# Altium schematic sheet MainBoard.SchDoc
size A3
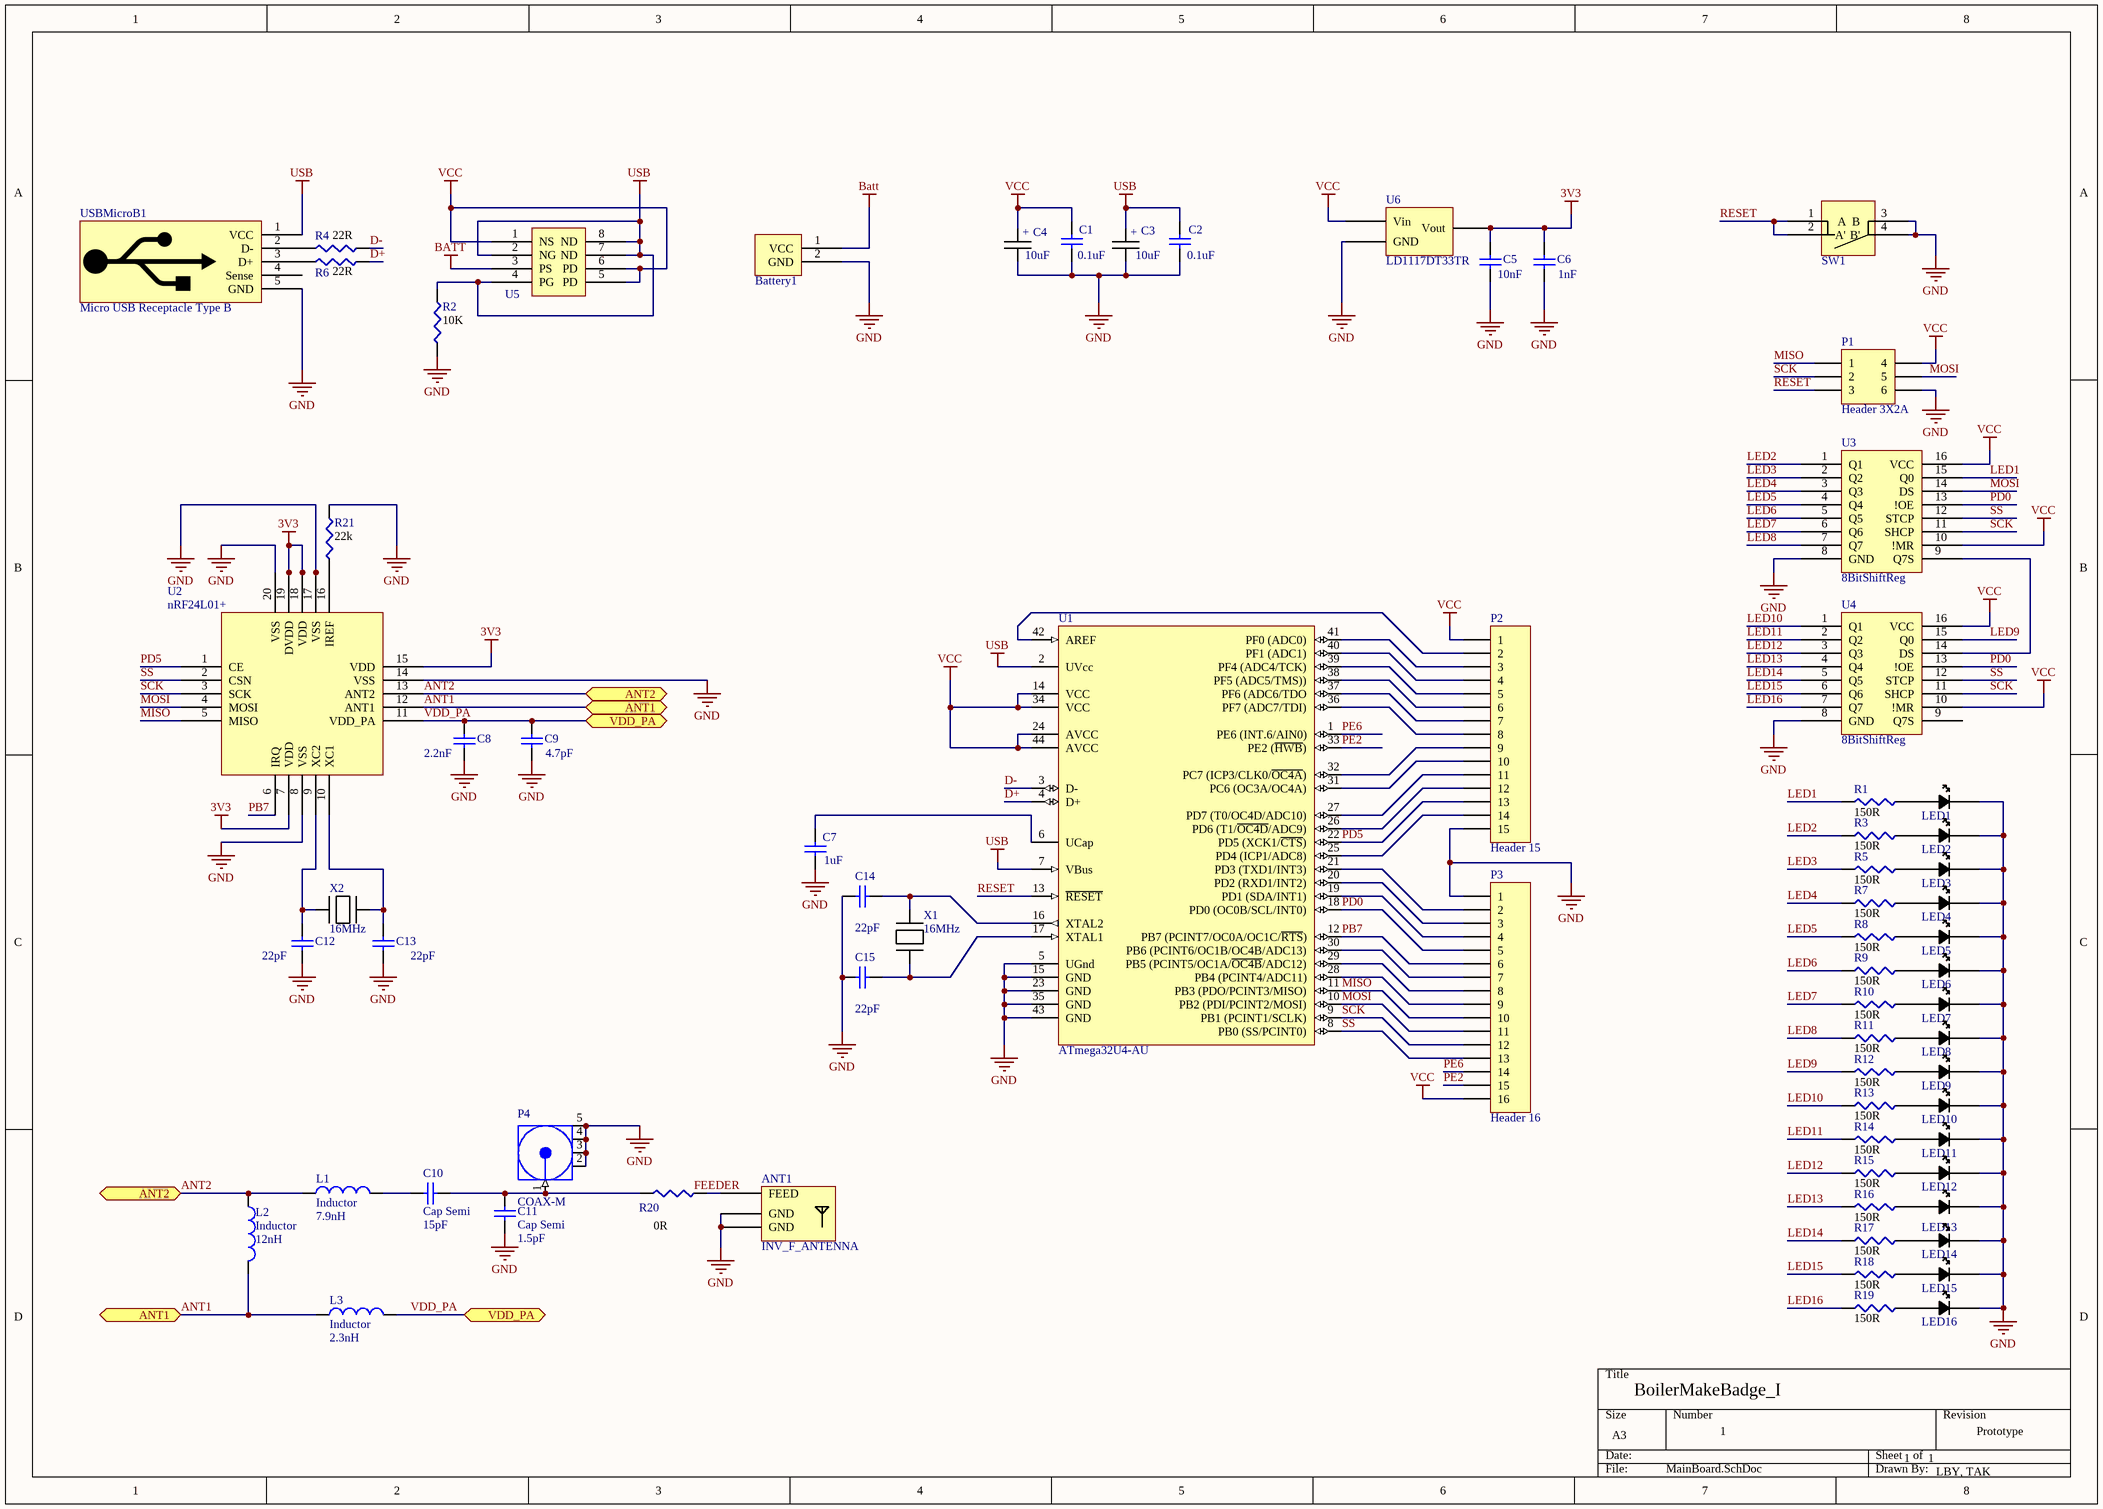
[diagram p0: MainBoard.SchDoc]

## Parts
ANT1  INV_F_ANTENNA  [INV_F_PCB_ANTENNA]
Battery1  PowerPins  [PowerPins_PCB]  (value not drawn)
C1  value 0.1uF  [C1206]  (hidden comment: Cap Semi)
C2  value 0.1uF  [C1206]  (hidden comment: Cap Semi)
C3  value 10uF  [sheityCapPackage]  (hidden comment: Electrolytic Capacitor)
C4  value 10uF  [sheityCapPackage]  (hidden comment: Electrolytic Capacitor)
C5  value 10nF  [C1206]  (hidden comment: Cap Semi)
C6  value 1nF  [C1206]  (hidden comment: Cap Semi)
C7  value 1uF  [C1206]  (hidden comment: Cap Semi)
C8  value 2.2nF  [0402]  (hidden comment: Cap Semi)
C9  value 4.7pF  [0402]  (hidden comment: Cap Semi)
C10  Cap Semi  value 15pF  [0402]
C11  Cap Semi  value 1.5pF  [C1206]
C12  value 22pF  [C1206]  (hidden comment: Cap Semi)
C13  value 22pF  [C1206]  (hidden comment: Cap Semi)
C14  value 22pF  [C1206]  (hidden comment: Cap Semi)
C15  value 22pF  [C1206]  (hidden comment: Cap Semi)
L1  Inductor  value 7.9nH  [0402-A]
L2  Inductor  value 12nH  [0402-A]
L3  Inductor  value 2.3nH  [0402-A]
LED1  LED_Green_1206Package  [1206Package_PCB]  (value not drawn)
LED2  LED_Green_1206Package  [1206Package_PCB]  (value not drawn)
LED3  LED_Green_1206Package  [1206Package_PCB]  (value not drawn)
LED4  LED_Green_1206Package  [1206Package_PCB]  (value not drawn)
LED5  LED_Green_1206Package  [1206Package_PCB]  (value not drawn)
LED6  LED_Green_1206Package  [1206Package_PCB]  (value not drawn)
LED7  LED_Green_1206Package  [1206Package_PCB]  (value not drawn)
LED8  LED_Green_1206Package  [1206Package_PCB]  (value not drawn)
LED9  LED_Green_1206Package  [1206Package_PCB]  (value not drawn)
LED10  LED_Green_1206Package  [1206Package_PCB]  (value not drawn)
LED11  LED_Green_1206Package  [1206Package_PCB]  (value not drawn)
LED12  LED_Green_1206Package  [1206Package_PCB]  (value not drawn)
LED13  LED_Green_1206Package  [1206Package_PCB]  (value not drawn)
LED14  LED_Green_1206Package  [1206Package_PCB]  (value not drawn)
LED15  LED_Green_1206Package  [1206Package_PCB]  (value not drawn)
LED16  LED_Green_1206Package  [1206Package_PCB]  (value not drawn)
P1  Header 3X2A  [HDR2X3_CEN]
P2  Header 15  [HDR1X15]
P3  Header 16  [HDR1X16]
P4  COAX-M  [MMCX2.54-V5]
R1  value 150R  [1206Package_PCB]  (hidden comment: Resistor_1206Package)
R2  value 10K  [1206Package_PCB]  (hidden comment: Resistor_1206Package)
R3  value 150R  [1206Package_PCB]  (hidden comment: Resistor_1206Package)
R4  value 22R  [1206Package_PCB]  (hidden comment: Resistor_1206Package)
R5  value 150R  [1206Package_PCB]  (hidden comment: Resistor_1206Package)
R6  value 22R  [1206Package_PCB]  (hidden comment: Resistor_1206Package)
R7  value 150R  [1206Package_PCB]  (hidden comment: Resistor_1206Package)
R8  value 150R  [1206Package_PCB]  (hidden comment: Resistor_1206Package)
R9  value 150R  [1206Package_PCB]  (hidden comment: Resistor_1206Package)
R10  value 150R  [1206Package_PCB]  (hidden comment: Resistor_1206Package)
R11  value 150R  [1206Package_PCB]  (hidden comment: Resistor_1206Package)
R12  value 150R  [1206Package_PCB]  (hidden comment: Resistor_1206Package)
R13  value 150R  [1206Package_PCB]  (hidden comment: Resistor_1206Package)
R14  value 150R  [1206Package_PCB]  (hidden comment: Resistor_1206Package)
R15  value 150R  [1206Package_PCB]  (hidden comment: Resistor_1206Package)
R16  value 150R  [1206Package_PCB]  (hidden comment: Resistor_1206Package)
R17  value 150R  [1206Package_PCB]  (hidden comment: Resistor_1206Package)
R18  value 150R  [1206Package_PCB]  (hidden comment: Resistor_1206Package)
R19  value 150R  [1206Package_PCB]  (hidden comment: Resistor_1206Package)
R20  value 0R  [1206Package_PCB]  (hidden comment: Resistor_1206Package)
R21  value 22k  [1206Package_PCB]  (hidden comment: Resistor_1206Package)
SW1  PushButton  [TactileSwitchPCB]  (value not drawn)
U1  ATmega32U4-AU  [44ML_N]
U2  nRF24L01+  [20-VFQFN]
U3  8BitShiftReg  [16-SOIC]
U4  8BitShiftReg  [16-SOIC]
U5  DualNP-ChFET  [8-SOIC]  (value not drawn)
U6  LD1117DT33TR  [DPAK]
USBMicroB1  Micro USB Receptacle Type B  [USBMicroB_PCB]
X1  value 16MHz  [HC-49S]  (hidden comment: HC-49S)
X2  value 16MHz  [HC-49S]  (hidden comment: HC-49S)

## Ports
ANT1, ANT2, VDD_PA

## Nets
3V3: C6.2 U2.7(VDD) U2.15(VDD) U2.18(VDD) U2.19(DVDD) U6.2(Vout)
Batt: Battery1.1(VCC) U5.3(PS)
GND: ANT1.1(GND) ANT1.2(GND) Battery1.2(GND) C1.1 C2.1 C3.2 C4.2 C5.1 C6.1 C7.2 C8.1 C9.1 C11.2 C12.1 C13.1 C14.2 C15.2 LED1.2 LED2.2 LED3.2 LED4.2 LED5.2 LED6.2 LED7.2 LED8.2 LED9.2 LED10.2 LED11.2 LED12.2 LED13.2 LED14.2 LED15.2 LED16.2 P1.6 P2.15 P3.1 P4.2(GND) P4.3(GND) P4.4(GND) P4.5(GND) R2.1 R21.2 SW1.3(B) SW1.4(B') U1.5(UGnd) U1.15(GND) U1.23(GND) U1.35(GND) U1.43(GND) U2.8(VSS) U2.14(VSS) U2.17(VSS) U2.20(VSS) U3.8(GND) U4.8(GND) U6.1(GND) USBMicroB1.5(GND)
USB: C2.2 C3.1 R2.2 U1.2(UVcc) U1.7(VBus) U5.2(NG) U5.4(PG) U5.7(ND) U5.8(ND) USBMicroB1.1(VCC)
VCC: C1.2 C4.1 P1.4 P2.1 P3.16 U1.14(VCC) U1.24(AVCC) U1.34(VCC) U1.44(AVCC) U3.10(!MR) U3.16(VCC) U4.10(!MR) U4.16(VCC) U5.1(NS) U5.5(PD) U5.6(PD) U6.3(Vin)
ANT1: L2.2 L3.1 U2.12(ANT1) ; port ANT1
ANT2: L1.1 L2.1 U2.13(ANT2) ; port ANT2
D+: R6.1 U1.4(D+)
D-: R4.1 U1.3(D-)
LED1: R1.1 U3.15(Q0)
LED2: R3.1 U3.1(Q1)
LED3: R5.1 U3.2(Q2)
LED4: R7.1 U3.3(Q3)
LED5: R8.1 U3.4(Q4)
LED6: R9.1 U3.5(Q5)
LED7: R10.1 U3.6(Q6)
LED8: R11.1 U3.7(Q7)
LED9: R12.1 U4.15(Q0)
LED10: R13.1 U4.1(Q1)
LED11: R14.1 U4.2(Q2)
LED12: R15.1 U4.3(Q3)
LED13: R16.1 U4.4(Q4)
LED14: R17.1 U4.5(Q5)
LED15: R18.1 U4.6(Q6)
LED16: R19.1 U4.7(Q7)
MISO: P1.1 P3.10 U1.11(PB3_(PDO/PCINT3/MISO)) U2.5(MISO)
MOSI: P1.5 P3.11 U1.10(PB2_(PDI/PCINT2/MOSI)) U2.4(MOSI) U3.14(DS)
PB7: P3.6 U1.12(PB7_(PCINT7/OC0A/OC1C/~{RTS})) U2.6(IRQ)
PD0: P3.5 U1.18(PD0_(OC0B/SCL/INT0)) U3.13(!OE) U4.13(!OE)
PD5: P2.13 U1.22(PD5_(XCK1/~{CTS})) U2.1(CE)
PE2: P3.15 U1.33(PE2_(~{HWB}))
PE6: P3.14 U1.1(PE6_(INT.6/AIN0))
RESET: P1.3 SW1.1(A) SW1.2(A') U1.13(~{RESET})
SCK: P1.2 P3.12 U1.9(PB1_(PCINT1/SCLK)) U2.3(SCK) U3.11(SHCP) U4.11(SHCP)
SS: P3.13 U1.8(PB0_(SS/PCINT0)) U2.2(CSN) U3.12(STCP) U4.12(STCP)
VDD_PA: C8.2 C9.2 L3.2 U2.11(VDD_PA) ; port VDD_PA
NetANT1_3: ANT1.3(FEED) R20.2
NetC7_1: C7.1 U1.6(UCap)
NetC10_1: C10.1 C11.1 P4.1(Signal) R20.1
NetC10_2: C10.2 L1.2
NetC12_2: C12.2 U2.9(XC2) X2.1
NetC13_2: C13.2 U2.10(XC1) X2.2
NetC14_1: C14.1 U1.16(XTAL2) X1.2
NetC15_1: C15.1 U1.17(XTAL1) X1.1
NetLED1_1: LED1.1 R1.2
NetLED2_1: LED2.1 R3.2
NetLED3_1: LED3.1 R5.2
NetLED4_1: LED4.1 R7.2
NetLED5_1: LED5.1 R8.2
NetLED6_1: LED6.1 R9.2
NetLED7_1: LED7.1 R10.2
NetLED8_1: LED8.1 R11.2
NetLED9_1: LED9.1 R12.2
NetLED10_1: LED10.1 R13.2
NetLED11_1: LED11.1 R14.2
NetLED12_1: LED12.1 R15.2
NetLED13_1: LED13.1 R16.2
NetLED14_1: LED14.1 R17.2
NetLED15_1: LED15.1 R18.2
NetLED16_1: LED16.1 R19.2
NetP2_2: P2.2 U1.42(AREF)
NetP2_3: P2.3 U1.41(PF0_(ADC0))
NetP2_4: P2.4 U1.40(PF1_(ADC1))
NetP2_5: P2.5 U1.39(PF4_(ADC4/TCK))
NetP2_6: P2.6 U1.38(PF5_(ADC5/TMS)))
NetP2_7: P2.7 U1.37(PF6_(ADC6/TDO)
NetP2_8: P2.8 U1.36(PF7_(ADC7/TDI))
NetP2_9: P2.9 U1.32(PC7_(ICP3/CLK0/~{OC4A}))
NetP2_10: P2.10 U1.31(PC6_(OC3A/OC4A))
NetP2_11: P2.11 U1.27(PD7_(T0/OC4D/ADC10))
NetP2_12: P2.12 U1.26(PD6_(T1/~{OC4D}/ADC9))
NetP2_14: P2.14 U1.25(PD4_(ICP1/ADC8))
NetP3_2: P3.2 U1.21(PD3_(TXD1/INT3))
NetP3_3: P3.3 U1.20(PD2_(RXD1/INT2))
NetP3_4: P3.4 U1.19(PD1_(SDA/INT1))
NetP3_7: P3.7 U1.30(PB6_(PCINT6/OC1B/OC4B/ADC13))
NetP3_8: P3.8 U1.29(PB5_(PCINT5/OC1A/~{OC4B}/ADC12))
NetP3_9: P3.9 U1.28(PB4_(PCINT4/ADC11))
NetR4_2: R4.2 USBMicroB1.2(D-)
NetR6_2: R6.2 USBMicroB1.3(D+)
NetR21_1: R21.1 U2.16(IREF)
NetU3_9: U3.9(Q7S) U4.14(DS)

Not connected (* = marked no-connect by the designer): C5 2; U4 9(Q7S); USBMicroB1 4(Sense)

## Notes on the sheet
- BoilerMakeBadge_I
- 1
- Prototype
- 1      1
- LBY, TAK
- Labels drawn without touching a wire or pin: FEEDER
- (in symbol Electrolytic Capacitor) +

## Library data of the parts
ANT1 = INV_V_ANTENNA
C1 C2 C5-C15 = Cap Semi: Capacitor (Semiconductor SIM Model); Published: 8-Jun-2000; LatestRevisionDate: 29-May-2009; LatestRevisionNote: IPC-7351 Footprint Added.; PackageReference: C1206; Publisher: Altium Limited; PackageDescription: Chip Capacitor
C3 C4 = Electrolytic Capacitor: asdf
L1-L3 = Inductor: Code_IEC: 1005; Published: 8-Jun-2000; LatestRevisionDate: 29-May-2009; LatestRevisionNote: IPC-7351 Footprint Added.; PackageReference: 0402-A; Publisher: Altium Limited; PackageDescription: Chip Inductor; Code_JEITA: 0402
LED1-LED16 = LED_Green_1206Package: Green LED
P1 = Header 3X2A: Header, 3-Pin, Dual row; LatestRevisionDate: 17-Jul-2002; LatestRevisionNote: Re-released for DXP Platform.; Publisher: Altium Limited
P2 = Header 15: Header, 15-Pin; LatestRevisionDate: 17-Jul-2002; LatestRevisionNote: Re-released for DXP Platform.; Publisher: Altium Limited
P3 = Header 16: Header, 16-Pin; LatestRevisionDate: 17-Jul-2002; LatestRevisionNote: Re-released for DXP Platform.; Publisher: Altium Limited
P4 = COAX-M: RF Coaxial PCB Connector, MMCX; Thru-Hole, Vertical Mount Plug,  50 Ohm Impedance; PackageDocument: Rev. A, 16-Jun-1997; PCB_Layout: Complies with manufacturer's recommendation.; DrillSize: Corresponds to nominal value.; Published: 15-Jul-2004; LatestRevisionDate: 15-Jul-2004; LatestRevisionNote: Component Replaced.; DatasheetDocument: 30-May-2003; PackageReference: 908-21103; Publisher: Altium Limited; ComponentLink1Description: Manufacturer Link; ComponentLink1URL: http://www.amphenolrf.com/
R1-R21 = Resistor_1206Package: Resistor 1206
SW1 = TactileButton: Normally open push button.
U1 = ATmega32U4-AU: 8-bit AVR Microcontroller, 2.7-5.5V, 32KB Flash, 2.5KB EEPROM, 1KB SRAM, USB Controller, 44-pin TQFP, Industrial Grade (-40°C to 85°C); Published: 1-Apr-2010; DatasheetVersion: revD, Jan-2009; PackageVersion: rev.G, Jul-2007; PackageReference: 44ML; Publisher: Altium Limited; PackageDescription: 44-Pin Plastic Thin Quad Flat Pack, 10 x 10 x 1.0 mm Body, 0.8 mm Pitch (TQFP); Supplier 1: Digi-Key; Supplier Part Number 1: ATMEGA32U4-AU-ND; Supplier 2: Farnell; Supplier Part Number 2: 1748525; Supplier 3: Mouser; Supplier Part Number 3: 556-ATMEGA32U4-AU; ComponentLink1Description: Manufacturer Link; ComponentLink1URL: http://www.atmel.com/products/avr/default.asp?; ComponentLink2Description: ATmega16U4/32U4 Datasheet; ComponentLink2URL: http://www.atmel.com/dyn/resources/prod_documents/doc7766.pdf; ComponentLink3Description: ATmega16U4 ATmega32U4 Summary; ComponentLink3URL: http://www.atmel.com/dyn/resources/prod_documents/7766S.pdf; ComponentLink4Description: Atmel.com Home; ComponentLink4URL: http://www.atmel.com
U2 = nRF24L01+: 2.4GHz RF Transceiver
U3 U4 = 8BitShiftRegister
U5 = Dual N & P-Channel MOSFET
USBMicroB1 = USBMicroB